# EAGLE schematic CS-N-DIY-5X (EAGLE 6.5.0)
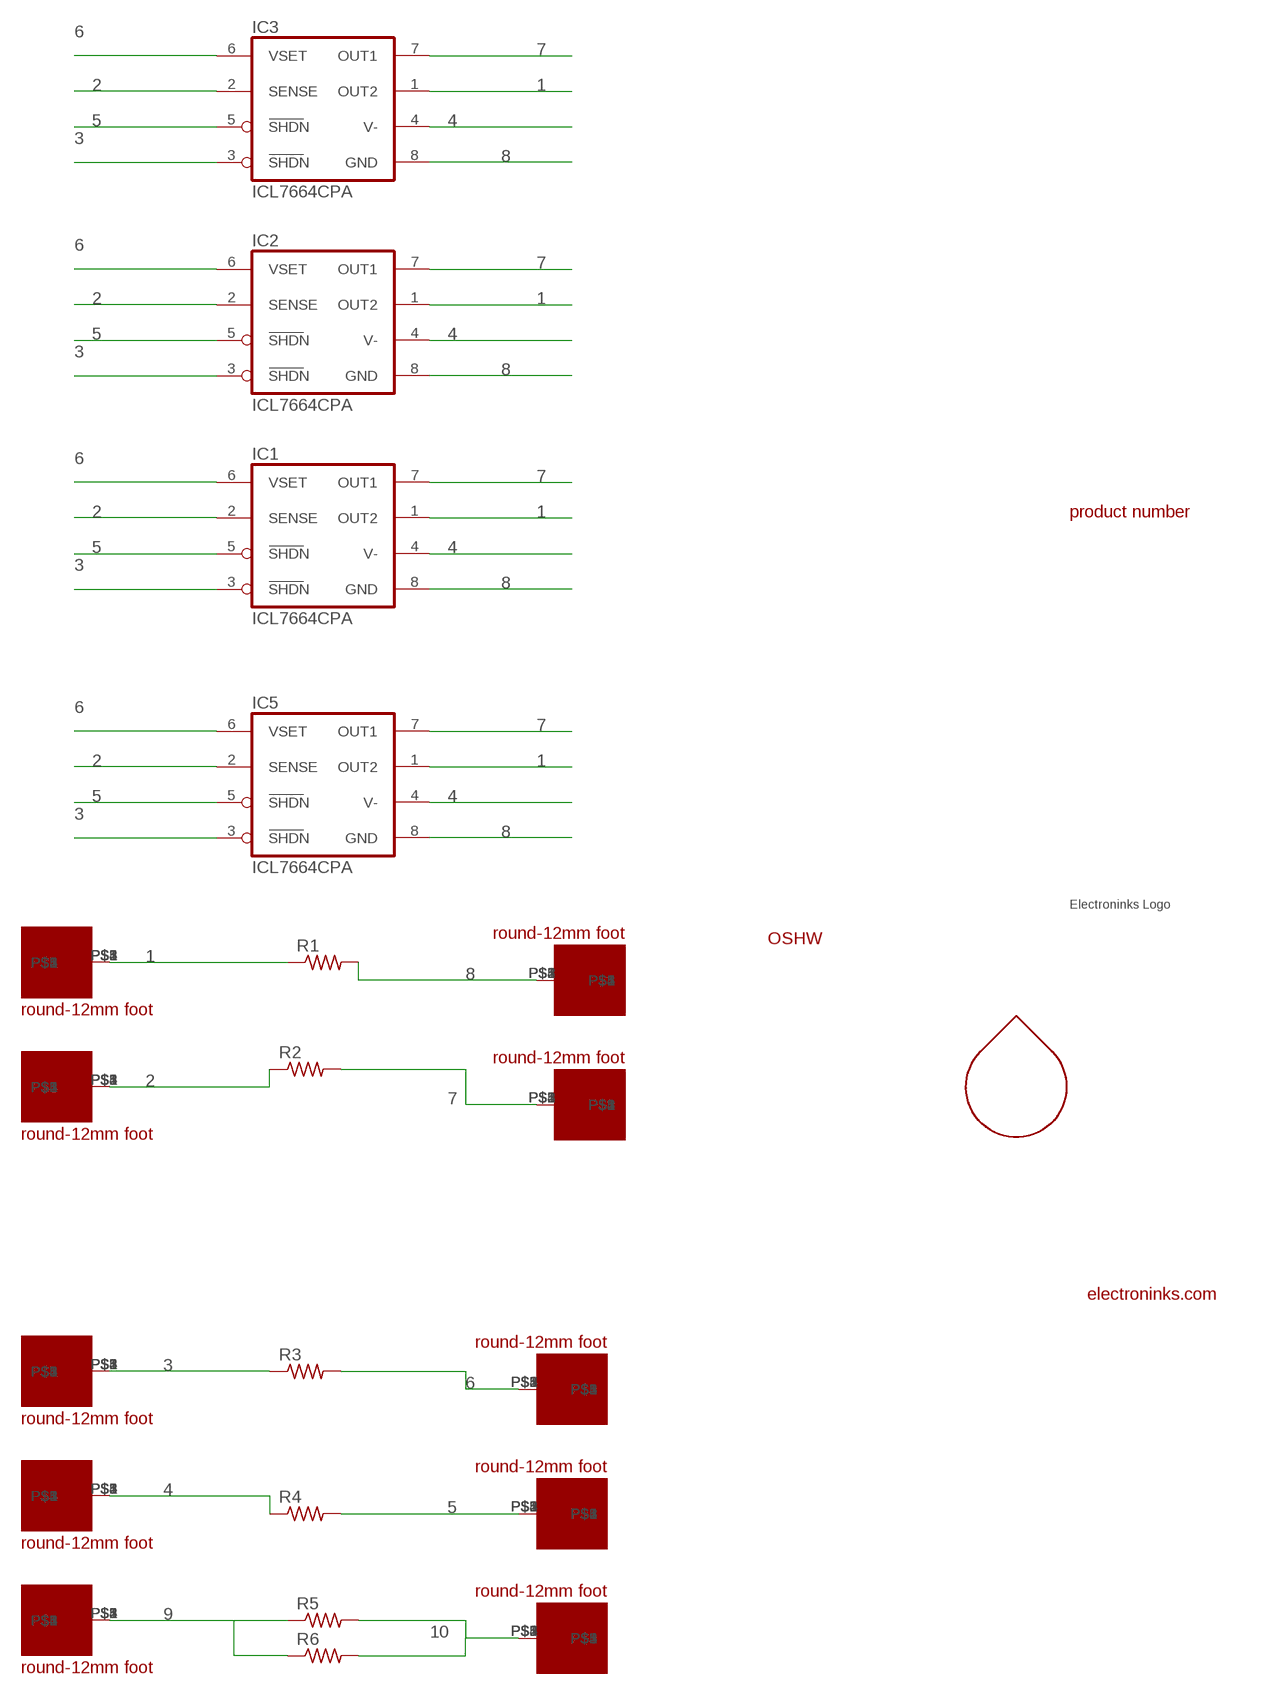
[diagram p0: schematic, sheet 1]

## Parts
IC1  ICL7664CPA  [DIL08]
IC2  ICL7664CPA  [DIL08]
IC3  ICL7664CPA  [DIL08]
IC5  ICL7664CPA  [DIL08]
R1  R-US_R1210  [R1210]
R2  R-US_R1210  [R1210]
R3  R-US_R1210  [R1210]
R4  R-US_R1210  [R1210]
R5  R-US_0207/10  [0207/10]
R6  R-US_R1210  [R1210]
U$1  ROUND-12MM-FOOT-1.8MM  [ROUND-12MM-FOOT]
U$2  ROUND-12MM-FOOT-1.8MM  [ROUND-12MM-FOOT]
U$3  ROUND-12MM-FOOT-1.8MM  [ROUND-12MM-FOOT]
U$4  ROUND-12MM-FOOT-1.8MM  [ROUND-12MM-FOOT]
U$5  ROUND-12MM-FOOT-1.8MM  [ROUND-12MM-FOOT]
U$6  ROUND-12MM-FOOT-1.8MM  [ROUND-12MM-FOOT]
U$7  ROUND-12MM-FOOT-1.8MM  [ROUND-12MM-FOOT]
U$8  ROUND-12MM-FOOT-1.8MM  [ROUND-12MM-FOOT]
U$9  ROUND-12MM-FOOT-1.8MM  [ROUND-12MM-FOOT]
U$10  ROUND-12MM-FOOT-1.8MM  [ROUND-12MM-FOOT]
U$11  ELECTRONINKS_LOGO_15MM  [ELECTRONINKS_LOGO_15MM]
U$12  ELECTRONINKS_COM_15MM  [ELECTRONINKS_COM_15MM]
U$13  DROPLET_LOGO_3MM  [DROPLET_LOGO_3MM]
U$14  OSHW_3MM  [OSHW_3MM]
U$15  CS_N_DIY_5X  [CS_N_DIY_5X]

## Nets
1: IC1.1(OUT2) IC2.1(OUT2) IC3.1(OUT2) IC5.1(OUT2) R1.1 U$1.P$1
2: IC1.2(SENSE) IC2.2(SENSE) IC3.2(SENSE) IC5.2(SENSE) R2.1 U$3.P$1
3: IC1.3(SHDN) IC2.3(SHDN) IC3.3(SHDN) IC5.3(SHDN) R3.1 U$5.P$1
4: IC1.4(V-) IC2.4(V-) IC3.4(V-) IC5.4(V-) R4.1 U$7.P$1
5: IC1.5(SHDN) IC2.5(SHDN) IC3.5(SHDN) IC5.5(SHDN) R4.2 U$8.P$1
6: IC1.6(VSET) IC2.6(VSET) IC3.6(VSET) IC5.6(VSET) R3.2 U$6.P$1
7: IC1.7(OUT1) IC2.7(OUT1) IC3.7(OUT1) IC5.7(OUT1) R2.2 U$4.P$1
8: IC1.8(GND) IC2.8(GND) IC3.8(GND) IC5.8(GND) R1.2 U$2.P$1
9: R5.1 R6.1 U$9.P$1
10: R5.2 R6.2 U$10.P$1
Unconnected: U$1.P$2 U$1.P$3 U$1.P$4 U$1.P$5 U$2.P$2 U$2.P$3 U$2.P$4 U$2.P$5 U$3.P$2 U$3.P$3 U$3.P$4 U$3.P$5 U$4.P$2 U$4.P$3 U$4.P$4 U$4.P$5 U$5.P$2 U$5.P$3 U$5.P$4 U$5.P$5 U$6.P$2 U$6.P$3 U$6.P$4 U$6.P$5 U$7.P$2 U$7.P$3 U$7.P$4 U$7.P$5 U$8.P$2 U$8.P$3 U$8.P$4 U$8.P$5 U$9.P$2 U$9.P$3 U$9.P$4 U$9.P$5 U$10.P$2 U$10.P$3 U$10.P$4 U$10.P$5

## Library data of the parts
IC1-IC3 IC5 = maxim:ICL7664CPA: Negative VOLTAGE REGULATOR; OC_FARNELL: unknown; OC_NEWARK: unknown
R1-R6 = resistor:R-US_: RESISTOR, American symbol
U$1-U$10 = electroninks:ROUND-12MM-FOOT-1.8MM
U$11 = electroninks:ELECTRONINKS_LOGO_15MM
U$12 = electroninks:ELECTRONINKS_COM_15MM
U$13 = electroninks:DROPLET_LOGO_3MM
U$14 = electroninks:OSHW_3MM
U$15 = electroninks:CS_N_DIY_5X